# EAGLE design U_I (EAGLE 7.3.0)
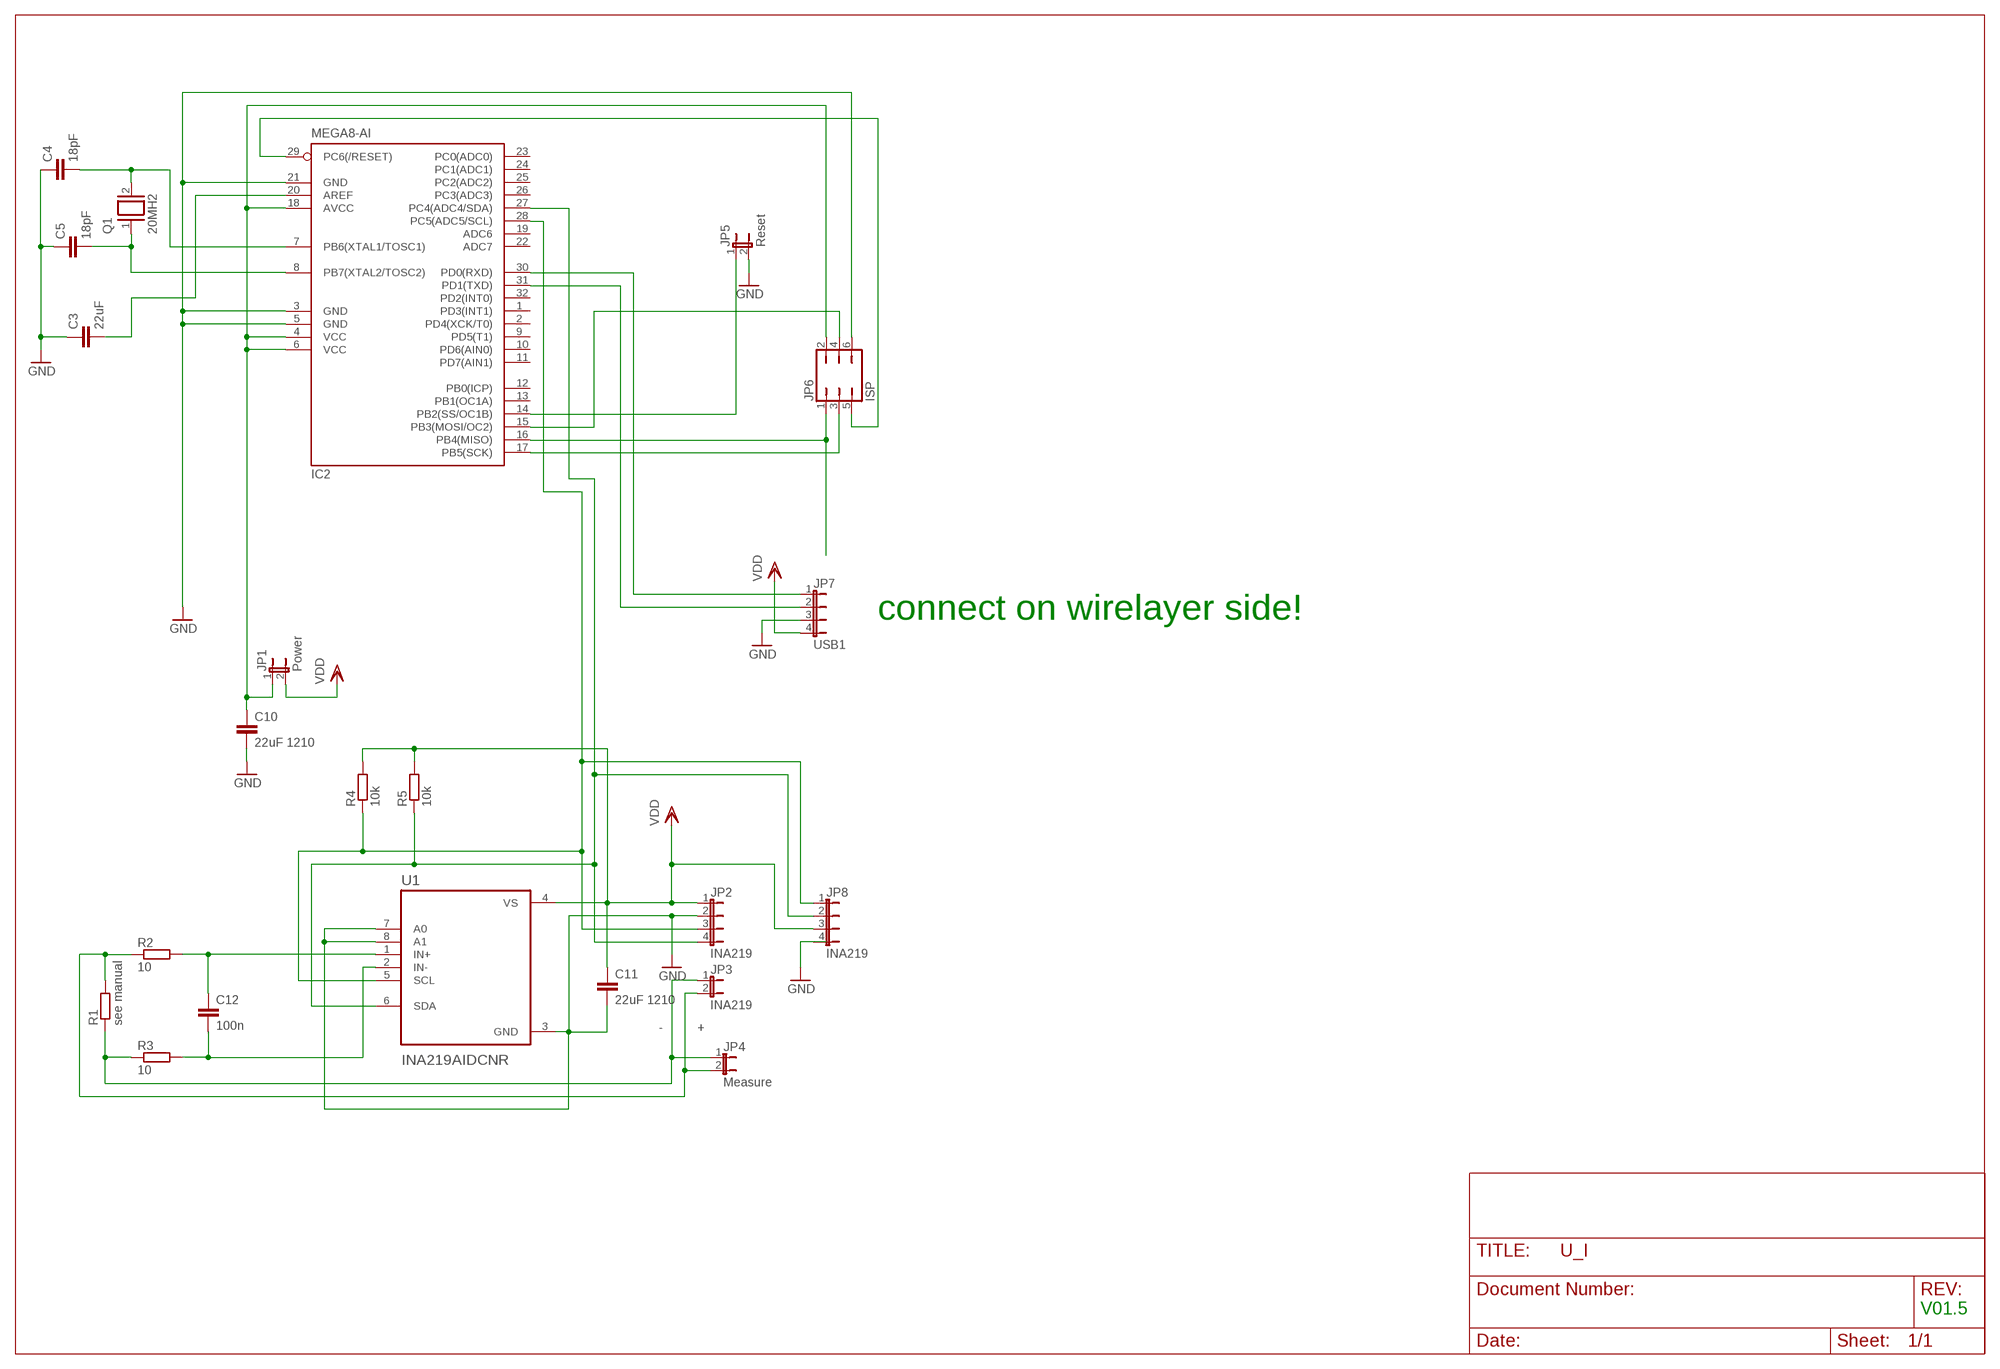
[diagram p0: schematic, sheet 1]

## Parts
C3  22uF  C-EUC1206  [C1206]
C4  18pF  C-EU025-025X050  [C025-025X050]
C5  18pF  C-EU025-025X050  [C025-025X050]
C10  22uF 1210  C-EUC1206  [C1206]
C11  22uF 1210  C-EUC1206  [C1206]
C12  100n  C-EUC1206  [C1206]
IC2  MEGA8-AI  [TQFP32-08]
JP1  Power  JP1E  [JP1]
JP2  INA219  JP4E  [JP4]
JP3  INA219  JP1E  [JP1]
JP4  Measure  JP1E  [JP1]
JP5  Reset  JP1E  [JP1]
JP6  ISP  JP3Q  [JP3Q]
JP7  USB1  JP4E  [JP4]
JP8  INA219  JP4E  [JP4]
Q1  20MH2  XTAL/S  [QS]
R1  see manual  R-EU_R1210  [R1210]
R2  10  R-EU_R1206  [R1206]
R3  10  R-EU_R1206  [R1206]
R4  10k  R-EU_R1206  [R1206]
R5  10k  R-EU_R1206  [R1206]
U1  INA219AIDCNR  [SOT65P280X145-8N]

## Nets
+: JP3.2 JP4.2 R1.2 R2.1
-: JP3.1 JP4.1 R1.1 R3.1
GND: C3.1 C4.1 C5.1 C10.2 C11.2 IC2.3(GND) IC2.5(GND) IC2.21(GND) JP2.2 JP5.2 JP6.6 JP7.3 U1.3(GND) U1.7(A0) U1.8(A1)
N$1: C12.1 R2.2 U1.1(IN+)
N$2: IC2.31(PD1(TXD)) JP7.2
N$4: IC2.16(PB4(MISO)) JP6.1
N$5: IC2.27(PC4(ADC4/SDA)) JP2.4 JP8.2 R5.1 U1.6(SDA)
N$7: C10.1 IC2.4(VCC) IC2.6(VCC) IC2.18(AVCC) JP1.1 JP6.2
N$8: C4.2 IC2.7(PB6(XTAL1/TOSC1)) Q1.2
N$9: IC2.15(PB3(MOSI/OC2)) JP6.4
N$12: IC2.30(PD0(RXD)) JP7.1
N$15: IC2.14(PB2(SS/OC1B)) JP5.1
N$18: IC2.29(PC6(/RESET)) JP6.5
N$19: C12.2 R3.2 U1.2(IN-)
N$21: C5.2 IC2.8(PB7(XTAL2/TOSC2)) Q1.1
N$22: IC2.28(PC5(ADC5/SCL)) JP2.3 JP8.1 R4.1 U1.5(SCL)
N$24: C3.2 IC2.20(AREF)
N$26: IC2.17(PB5(SCK)) JP6.3
VDD: C11.1 JP1.2 JP2.1 JP7.4 JP8.3 R4.2 R5.2 U1.4(VS)
Unconnected: IC2.1(PD3(INT1)) IC2.2(PD4(XCK/T0)) IC2.9(PD5(T1)) IC2.10(PD6(AIN0)) IC2.11(PD7(AIN1)) IC2.12(PB0(ICP)) IC2.13(PB1(OC1A)) IC2.19(ADC6) IC2.22(ADC7) IC2.23(PC0(ADC0)) IC2.24(PC1(ADC1)) IC2.25(PC2(ADC2)) IC2.26(PC3(ADC3)) IC2.32(PD2(INT0)) JP8.4

## Notes on the sheet
- connect on wirelayer side!
- V01.5

## Library data of the parts
C3 C10-C12 = rcl:C-EU: CAPACITOR, European symbol
C4 C5 = resistor:C-EU: CAPACITOR, European symbol
IC2 = atmel:MEGA8: MICROCONTROLLER 8 Kbytes FLASH, 1 kbytes SRAM, 512 bytes EEPROM, USART, 6-channel 10 bit ADC, 2-channel 8 bit ADC Pin compatible with Atmega48, ATMega88, ATMega168 Source: avr.lbr; MPN: ATMEGA8-16AU; OC_FARNELL: 9171371; OC_NEWARK: 73M8863
JP1 JP3-JP5 = jumper:JP1E: JUMPER
JP2 JP7 JP8 = jumper:JP4E: JUMPER
JP6 = jumper:JP3Q: JUMPER
Q1 = special:XTAL/S: CRYSTAL
R1-R5 = resistor:R-EU_: RESISTOR, European symbol
U1 = INA219AIDCNR:INA219AIDCNR: Check availability <https://pricing.snapeda.com/parts/INA219AIDCNR/Texas%20Instruments/view-part?ref=eda>; AVAILABILITY: In Stock; CHECK_PRICES: https://www.snapeda.com/parts/INA219AIDCNR/Texas+Instruments/view-part/?ref=eda; DESCRIPTION: 26-V 12-bit I2C output digital power monitor; MF: Texas Instruments; MP: INA219AIDCNR; PACKAGE: SOT-23-8 Texas Instruments; PRICE: None; SNAPEDA_LINK: https://www.snapeda.com/parts/INA219AIDCNR/Texas+Instruments/view-part/?ref=snap

## Board
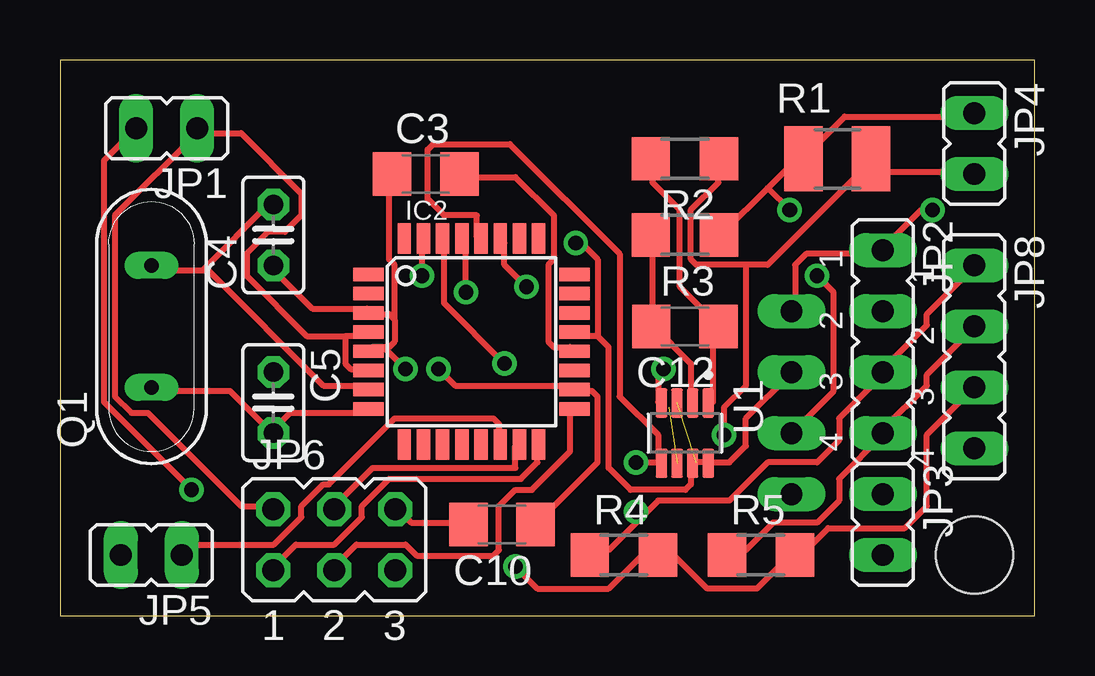
[diagram p1: board, top side]
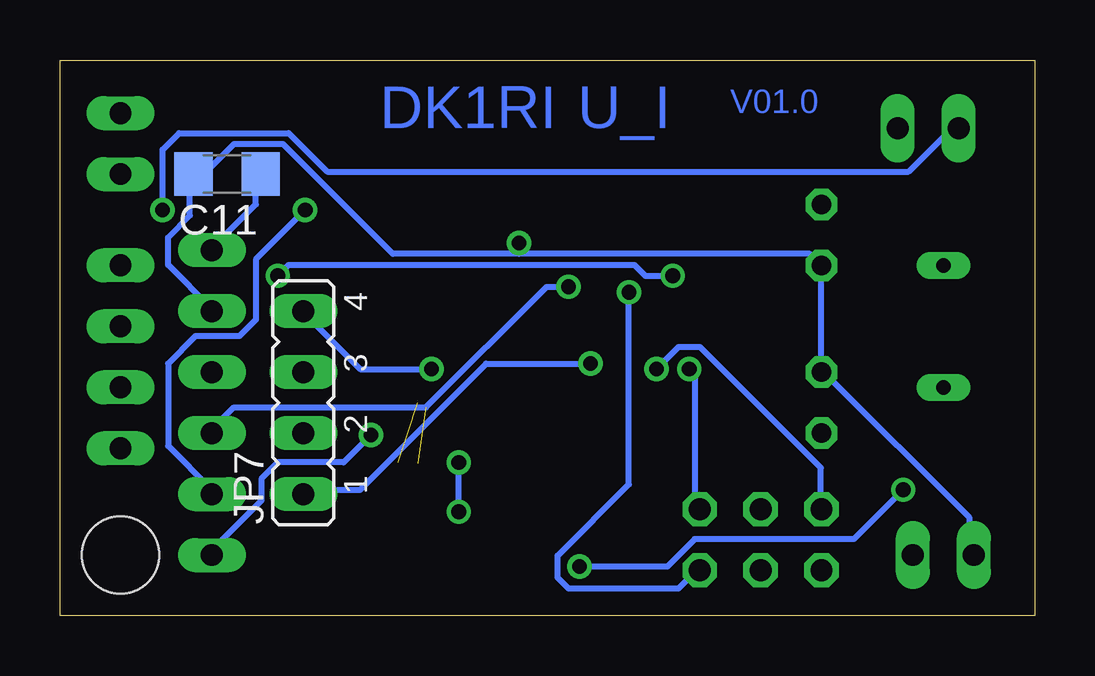
[diagram p2: board, bottom side, seen from below]

Size 40.62 x 23.16 mm. Coordinates in mm from the lower left corner, seen from the top.
Outline: 0,0 40.62,0 40.62,23.16 0,23.16 0,0
Copper layers (1*16): Top 0.035mm / dielectric 1.5mm / Bottom 0.035mm
Design rules "default": minimum track width 10mil, minimum drill 24mil, track to track 8mil, track to pad 8mil, pad to pad 8mil, via to via 8mil, smd to smd 8mil, copper to edge 40mil, drill to drill 8mil, minimum pad ring 10mil, minimum via ring 8mil, stop-mask expansion 4mil, vias tented up to drill 0mil, thermal gap 10mil
Holes 3.2 mm at 38.1,2.54

### Footprints (pad centres in the part's own frame; a part is rotated, then mirrored left to right if it is on the bottom)
C1206 = smd 1.6 x 1.8: 1 -1.4,0; 2 1.4,0
C025-025X050 = drill 0.813 octagon: 1 -1.27,0; 2 1.27,0
TQFP32-08 = smd 1.27 x 0.559: 1 -4.293,2.8; 2 -4.293,2; 3 -4.293,1.2; 4 -4.293,0.4; 5 -4.293,-0.4; 6 -4.293,-1.2; 7 -4.293,-2; 8 -4.293,-2.8; 17 4.293,-2.8; 18 4.293,-2; 19 4.293,-1.2; 20 4.293,-0.4; 21 4.293,0.4; 22 4.293,1.2; 23 4.293,2; 24 4.293,2.8 | smd 0.559 x 1.27: 9 -2.8,-4.293; 10 -2,-4.293; 11 -1.2,-4.293; 12 -0.4,-4.293; 13 0.4,-4.293; 14 1.2,-4.293; 15 2,-4.293; 16 2.8,-4.293; 25 2.8,4.293; 26 2,4.293; 27 1.2,4.293; 28 0.4,4.293; 29 -0.4,4.293; 30 -1.2,4.293; 31 -2,4.293; 32 -2.8,4.293
JP1 = drill 0.914 long: 1 0,-1.27; 2 0,1.27
JP4 = drill 0.914 long: 1 -3.81,0; 2 -1.27,0; 3 1.27,0; 4 3.81,0
JP3Q = drill 0.914 octagon: 1 -2.54,-1.27; 2 -2.54,1.27; 3 0,-1.27; 4 0,1.27; 5 2.54,-1.27; 6 2.54,1.27
QS = drill 0.61 long: 1 -2.54,0; 2 2.54,0
R1210 = smd 1.6 x 2.7: 1 -1.4,0; 2 1.4,0
R1206 = smd 1.6 x 1.803: 1 -1.422,0; 2 1.422,0
SOT65P280X145-8N = smd 1.21 x 0.48: 1 -1.255,0.975; 2 -1.255,0.325; 3 -1.255,-0.325; 4 -1.255,-0.975; 5 1.255,-0.975; 6 1.255,-0.325; 7 1.255,0.325; 8 1.255,0.975

### Placement (x,y rotation side)
C3  15.24,18.41 0 top
C4  8.89,15.88 90 top
C5  8.89,8.89 270 top
C10  18.41,3.81 180 top
C11  33.66,18.41 180 bottom
C12  26.04,12.06 180 top
IC2  17.14,11.43 0 top
JP1  4.45,20.32 90 top
JP2  34.29,11.43 270 top
JP3  34.29,3.81 180 top
JP4  38.1,19.68 180 top
JP5  3.81,2.54 90 top
JP6  11.43,3.17 0 top
JP7  30.48,8.89 90 bottom
JP8  38.1,10.79 270 top
Q1  3.81,12.06 90 top
R1  32.38,19.05 0 top
R2  26.04,19.05 180 top
R3  26.04,15.88 180 top
R4  23.5,2.54 0 top
R5  29.21,2.54 0 top
U1  26.04,7.62 270 top

### Tracks (layer width: path | path; a pad name or v marks a point on that pad's centre or on a via)
+  (via drill 0.61)
  Top 0.254: 28.57,14.63 29.49,14.63 33.83,18.97 | 28.57,14.63 26.52,14.63 26.29,14.86 26.29,16.92 27.43,18.06 27.43,18.97 R2.1 | v27.66,7.54 27.66,8.69 28.57,9.6 28.57,14.63 | 33.83,18.97 34.29,18.52 37.95,18.52 JP4.2 | 33.83,18.97 R1.2
  Bottom 0.254: v27.66,7.54 28.8,6.4 31.55,6.4 32.23,5.71 32.23,4.8 34.29,2.74 JP3.2
-  (via drill 0.61)
  Top 0.254: 29.49,17.83 30.86,19.2 R1.1 31.09,19.2 32.69,20.8 37.95,20.8 JP4.1 | 29.49,17.83 27.66,16 R3.1 | 29.49,17.83 v30.4,16.92
  Bottom 0.254: v30.4,16.92 32.46,14.86 32.46,12.34 33.15,11.66 34.98,11.66 36.12,10.52 36.12,7.09 34.29,5.26 JP3.1
GND  (via drill 0.61)  (1 unrouted)
  Top 0.254: C10.2 16.92,3.89 14.63,3.89 14.17,4.34 JP6.6 | 13.49,11.2 13.72,11.2 13.95,11.43 13.95,12.34 | 13.49,11.2 13.03,11.2 IC2.5 | 13.95,12.34 13.72,12.57 13.03,12.57 IC2.3 12.8,12.8 10.52,12.8 8.91,14.4 C4.1 | 13.95,12.34 13.95,14.63 13.72,14.86 13.72,18.29 C3.1 | 13.49,11.2 v14.4,10.29 | 22.4,11.66 21.49,11.66 IC2.21 | 22.4,11.66 22.86,11.2 22.86,6.17 23.77,5.26 26.06,5.26 26.29,5.49 26.29,6.17 U1.7 26.52,6.4 26.98,6.4 U1.8 27.2,6.4 27.89,6.4 28.57,7.09 28.57,8.23 30.4,10.06 JP7.3 | 22.4,11.66 22.4,14.86 21.72,15.54 v21.49,15.54
  Bottom 0.254: v14.4,10.29 14.17,10.06 14.17,4.57 JP6.6 | JP2.2 34.29,12.8 36.12,14.63 36.12,15.77 35.2,16.69 35.2,18.29 C11.2 34.98,18.52 34.52,18.52 33.38,19.66 31.32,19.66 26.75,15.09 21.49,15.09 | JP5.2 2.74,2.74 2.74,4.12 8.69,10.06 C5.1 8.91,10.29 8.91,14.4 C4.1 9.37,15.09 21.49,15.09 | 21.49,15.09 v21.49,15.54
N$1
  Top 0.254: U1.1 27.2,8.91 27.2,11.66 27.43,11.89 C12.1 27.43,12.12 25.83,13.72 25.83,16.92 24.69,18.06 24.69,18.97 R2.2
N$2  (via drill 0.61)
  Top 0.254: v15.09,14.17 15.09,15.54 IC2.31 | v31.55,14.17 32.23,13.49 32.23,9.37 JP7.2
  Bottom 0.254: v15.09,14.17 16.23,14.17 16.69,14.63 31.09,14.63 v31.55,14.17
N$4
  Top 0.254: IC2.16 19.89,7.09 19.89,6.4 19.2,5.71 13.72,5.71 12.57,4.57 12.57,4.12 11.43,2.97 9.83,2.97 8.91,2.06 JP6.1
N$5  (via drill 0.61)  (1 unrouted)
  Top 0.254: v19.43,13.72 18.52,14.63 18.52,15.54 IC2.27 | R5.1 27.89,2.74 28.57,2.74 29.72,3.89 31.55,3.89 32.46,4.8 32.46,5.71 34.29,7.54 JP2.4 34.29,7.77 36.12,9.6 36.12,10.06 37.95,11.89 JP8.2
  Bottom 0.254: v19.43,13.72 20.34,13.72 25.38,8.69 33.38,8.69 34.29,7.77 JP2.4
N$7  (via drill 0.61)
  Top 0.254: C10.1 19.89,3.89 22.4,6.4 22.4,9.14 22.17,9.37 21.49,9.37 IC2.18 21.26,9.6 16.46,9.6 v15.77,10.29 | 11.89,11.66 11.89,10.52 12.12,10.29 12.8,10.29 IC2.6 | 11.89,11.66 12.8,11.66 IC2.4 | 11.89,11.66 10.29,11.66 7.77,14.17 7.77,15.09 8.69,16 9.37,16 10.06,16.69 10.06,17.6 7.54,20.12 5.71,20.12 | 5.71,20.12 2.29,16.69 2.29,9.14 2.97,8.46 3.66,8.46 7.54,4.57 8.69,4.57 JP6.2 | 5.71,20.12 JP1.1
  Bottom 0.254: v15.77,10.29 14.86,11.2 13.95,11.2 8.91,6.17 8.91,4.57 JP6.2
N$8
  Top 0.254: 5.94,14.4 3.89,14.4 Q1.2 | 5.94,14.4 6.17,14.4 10.97,9.6 12.8,9.6 IC2.7 | 5.94,14.4 8.69,17.14 C4.2
N$9
  Top 0.254: IC2.15 18.97,7.09 18.97,6.17 13.03,6.17 11.43,4.57 JP6.4
N$12  (via drill 0.61)
  Top 0.254: v18.52,10.52 16,13.03 16,15.54 IC2.30
  Bottom 0.254: v18.52,10.52 22.86,10.52 28.12,5.26 30.4,5.26 JP7.1
N$15
  Top 0.254: IC2.14 18.29,7.32 18.29,8 18.06,8.23 13.95,8.23 11.2,5.49 10.97,5.49 10.06,4.57 10.06,4.12 8.91,2.97 5.49,2.97 5.26,2.74 JP5.1
N$18  (via drill 0.61)
  Top 0.254: v16.92,13.49 16.92,15.54 IC2.29
  Bottom 0.254: v16.92,13.49 16.92,5.49 19.89,2.52 19.89,1.6 19.43,1.14 14.86,1.14 14.17,1.83 JP6.5
N$19
  Top 0.254: 24.69,12.12 26.29,10.52 26.29,8.91 U1.2 | 24.69,12.12 24.69,15.77 R3.2 | 24.69,12.12 C12.2
N$21
  Top 0.254: IC2.8 12.8,8.46 9.6,8.46 8.91,7.77 C5.2 8.69,7.77 7.09,9.37 3.89,9.37 Q1.1
N$22  (via drill 0.61)
  Top 0.254: 24.92,6.4 24.92,7.54 23.32,9.14 23.32,15.09 18.75,19.66 15.54,19.66 15.32,19.43 15.32,17.37 16,16.69 17.37,16.69 17.37,15.77 IC2.28 | 24.23,4.12 24.92,4.8 27.89,4.8 29.49,6.4 31.55,6.4 32.46,7.32 32.46,8.23 34.29,10.06 JP2.3 34.29,10.29 36.12,12.12 36.12,12.57 37.95,14.4 JP8.1 | 24.23,4.12 22.86,2.74 22.17,2.74 R4.1 | v24,6.4 24.92,6.4 | 24.23,4.12 v24,4.34 | 24.92,6.4 U1.5
  Bottom 0.254: v24,4.34 v24,6.4
N$24
  Top 0.254: IC2.20 21.26,11.2 20.57,11.2 20.34,11.43 20.34,14.63 20.57,14.86 20.57,16.69 18.97,18.29 16.69,18.29 C3.2
N$26
  Top 0.254: IC2.17 21.26,8.46 21.26,6.86 19.66,5.26 18.97,5.26 18.29,4.57 18.29,2.74 18.06,2.52 14.86,2.52 14.4,2.97 12.34,2.97 11.43,2.06 JP6.3
VDD  (via drill 0.61)
  Top 0.254: JP8.3 36.12,7.54 36.12,4.57 35.2,3.66 32,3.66 31.09,2.74 30.63,2.74 R5.2 30.4,2.52 29.03,1.14 26.98,1.14 25.6,2.52 24.92,2.52 R4.2 24.69,2.52 24.23,2.52 22.86,1.14 19.89,1.14 v18.97,2.06 | v25.15,10.29 24.92,10.06 24.92,8.91 U1.4 | v36.35,16.92 35.89,16.92 34.29,15.32 JP2.1 34.29,15.09 31.09,15.09 30.63,14.63 30.63,12.8 JP7.4 | v5.49,5.26 1.83,8.91 1.83,18.97 JP1.2
  Bottom 0.254: v25.15,10.29 28.12,10.29 30.4,12.57 JP7.4 | C11.1 32.46,18.29 32.46,17.14 34.29,15.32 JP2.1 | v36.35,16.92 36.35,19.43 35.66,20.12 31.09,20.12 29.49,18.52 5.26,18.52 3.66,20.12 3.2,20.12 JP1.2 | v18.97,2.06 15.32,2.06 14.17,3.2 7.54,3.2 v5.49,5.26

### Text on the board
Bottom: V01.0 | U_I | DK1RI